# EAGLE schematic k1 (EAGLE 9.0.0)
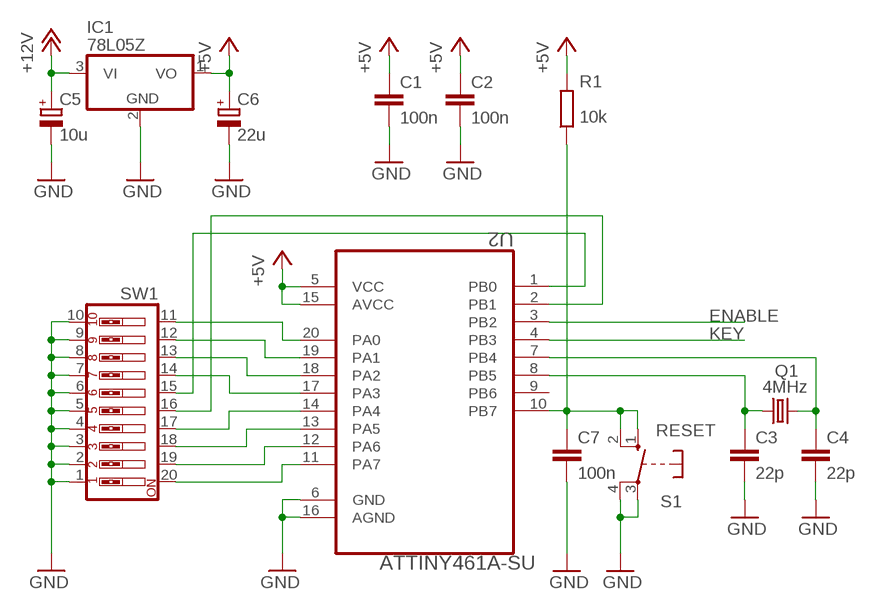
[diagram p0: schematic, sheet 1]

## Parts
C1  100n  C-EU025-024X044  [C025-024X044]
C2  100n  C-EU025-024X044  [C025-024X044]
C3  22p  C-EU025-024X044  [C025-024X044]
C4  22p  C-EU025-024X044  [C025-024X044]
C5  10u  CPOL-EUE2.5-5  [E2,5-5]
C6  22u  CPOL-EUE2.5-5  [E2,5-5]
C7  100n  C-EU025-024X044  [C025-024X044]
IC1  78L05Z  [TO92]
Q1  4MHz  CRYSTALHC49S  [HC49/S]
R1  10k  R-EU_0207/10  [0207/10]
S1  RESET  RACON12  [RACON12]
SW1  SW_DIP-10  [EDG-10]
U2  ATTINY461A-SU  [SOIC127P1032X265-20N]

## Nets
+5V: C1.1 C2.1 C6.+ IC1.1(VO) R1.2 U2.5(VCC) U2.15(AVCC)
+12V: C5.+ IC1.3(VI)
ENABLE: U2.3(PB2)
GND: C1.2 C2.2 C3.2 C4.2 C5.- C6.- C7.2 IC1.2(GND) S1.3(P) S1.4(P) SW1.1 SW1.2 SW1.3 SW1.4 SW1.5 SW1.6 SW1.7 SW1.8 SW1.9 SW1.10 U2.6(GND) U2.16(AGND)
KEY: U2.4(PB3)
N$1: SW1.20 U2.11(PA7)
N$2: C7.1 R1.1 S1.1(S) S1.2(S) U2.10(PB7)
N$3: SW1.19 U2.12(PA6)
N$4: SW1.18 U2.13(PA5)
N$5: C3.1 Q1.1 U2.8(PB5)
N$6: C4.1 Q1.2 U2.7(PB4)
N$7: SW1.17 U2.14(PA4)
N$8: SW1.11 U2.20(PA0)
N$9: SW1.12 U2.19(PA1)
N$10: SW1.13 U2.18(PA2)
N$11: SW1.14 U2.17(PA3)
N$12: SW1.15 U2.1(PB0)
N$13: SW1.16 U2.2(PB1)
Unconnected: U2.9(PB6)

## Library data of the parts
C1-C4 C7 = rcl:C-EU: CAPACITOR, European symbol; SPICEPREFIX: C
C5 C6 = rcl:CPOL-EU: POLARIZED CAPACITOR, European symbol; SPICEPREFIX: C
IC1 = linear:78*: Positive VOLTAGE REGULATOR Source: http://cache.national.com/ds/LM/LM78L05.pdf http://www.fairchildsemi.com/ds/LM/LM7805.pdf
Q1 = crystal:CRYSTAL: CRYSTAL; OC_FARNELL: 1667008; OC_NEWARK: unknown
R1 = rcl:R-EU_: RESISTOR, European symbol; SPICEPREFIX: R
S1 = switch-misc:RACON12: ITT SWITCH
SW1 = special:SW_DIP-10: DIP SWITCH
U2 = Atmel_By_element14_Batch_1-00:ATTINY461A-SU: 8-bit Microcontroller with In-System Programmable Flash; MPN: ATTINY461A-SU; OC_FARNELL: 1841624; OC_NEWARK: 12T1341; PACKAGE: SOIC-20; SUPPLIER: Atmel